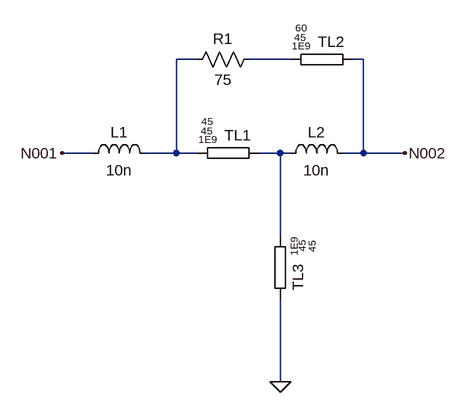
[diagram p0: schematic LineaTransmision2.asc]
LineaTransmision2.asc, the LTspice schematic file:
Version 4
SHEET 1 880 680
WIRE 384 16 352 16
WIRE 528 16 464 16
WIRE 640 16 624 16
WIRE 224 160 176 160
WIRE 352 160 352 16
WIRE 352 160 304 160
WIRE 384 160 352 160
WIRE 512 160 480 160
WIRE 528 160 512 160
WIRE 640 160 640 16
WIRE 640 160 608 160
WIRE 704 160 640 160
WIRE 512 288 512 160
WIRE 512 512 512 384
FLAG 176 160 N001
FLAG 704 160 N002
FLAG 512 512 0
SYMBOL TL 432 160 R0
SYMATTR SpiceModel 45
SYMATTR Value 45
SYMATTR Value2 1E9
SYMATTR InstName TL1
SYMBOL ind 208 176 R270
WINDOW 0 32 56 VTop 2
WINDOW 3 5 56 VBottom 2
SYMATTR InstName L1
SYMATTR Value 10n
SYMBOL ind 512 176 R270
WINDOW 0 32 56 VTop 2
WINDOW 3 5 56 VBottom 2
SYMATTR InstName L2
SYMATTR Value 10n
SYMBOL TL 576 16 R0
SYMATTR SpiceModel 60
SYMATTR Value 45
SYMATTR Value2 1E9
SYMATTR InstName TL2
SYMBOL res 368 32 R270
WINDOW 0 32 56 VTop 2
WINDOW 3 0 56 VBottom 2
SYMATTR InstName R1
SYMATTR Value 75
SYMBOL TL 512 336 R90
SYMATTR SpiceModel 45
SYMATTR Value 45
SYMATTR Value2 1E9
SYMATTR InstName TL3

The netlist it stands for:
* LineaTransmision2.asc
TL1 N003 N005 45 45 1E9
L1 N001 N003 10n
L2 N005 N002 10n
TL2 N004 N002 60 45 1E9
R1 N003 N004 75
TL3 N005 0 45 45 1E9
.backanno
.end